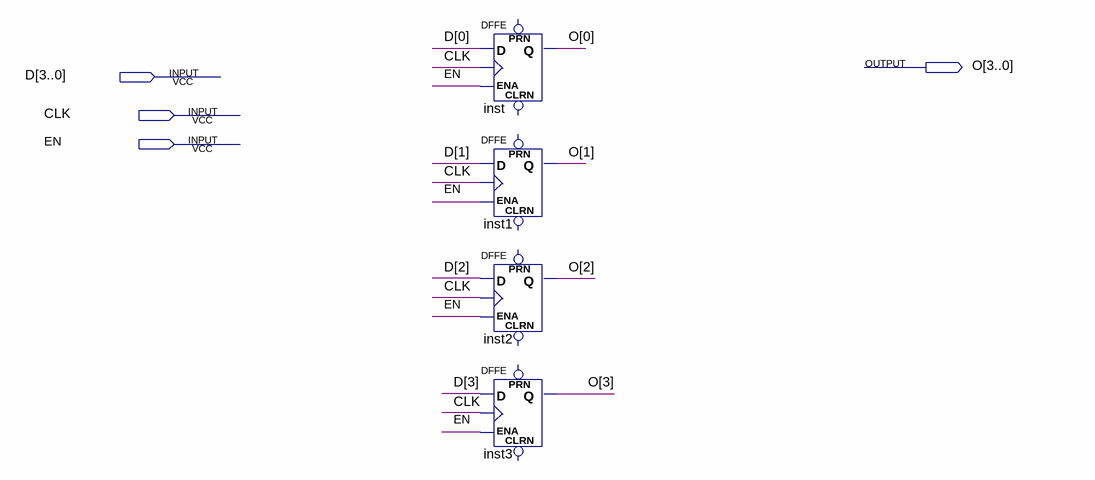
[diagram p0: schematic sheet]
// Quartus schematic Reg.bdf as structural Verilog: 4 symbols, 4 pins
module Reg (
  input  [3:0] D,
  input  CLK,
  input  EN,
  output [3:0] O
);

  DFFE inst (.D(D[0]), .CLK(CLK), .ENA(EN), .Q(O[0]));  // open: PRN, CLRN
  DFFE inst1 (.D(D[1]), .CLK(CLK), .ENA(EN), .Q(O[1]));  // open: PRN, CLRN
  DFFE inst2 (.D(D[2]), .CLK(CLK), .ENA(EN), .Q(O[2]));  // open: PRN, CLRN
  DFFE inst3 (.D(D[3]), .CLK(CLK), .ENA(EN), .Q(O[3]));  // open: PRN, CLRN
endmodule
